# EAGLE schematic SparkFun_lsm9ds0-breakout (EAGLE 6.5.0)
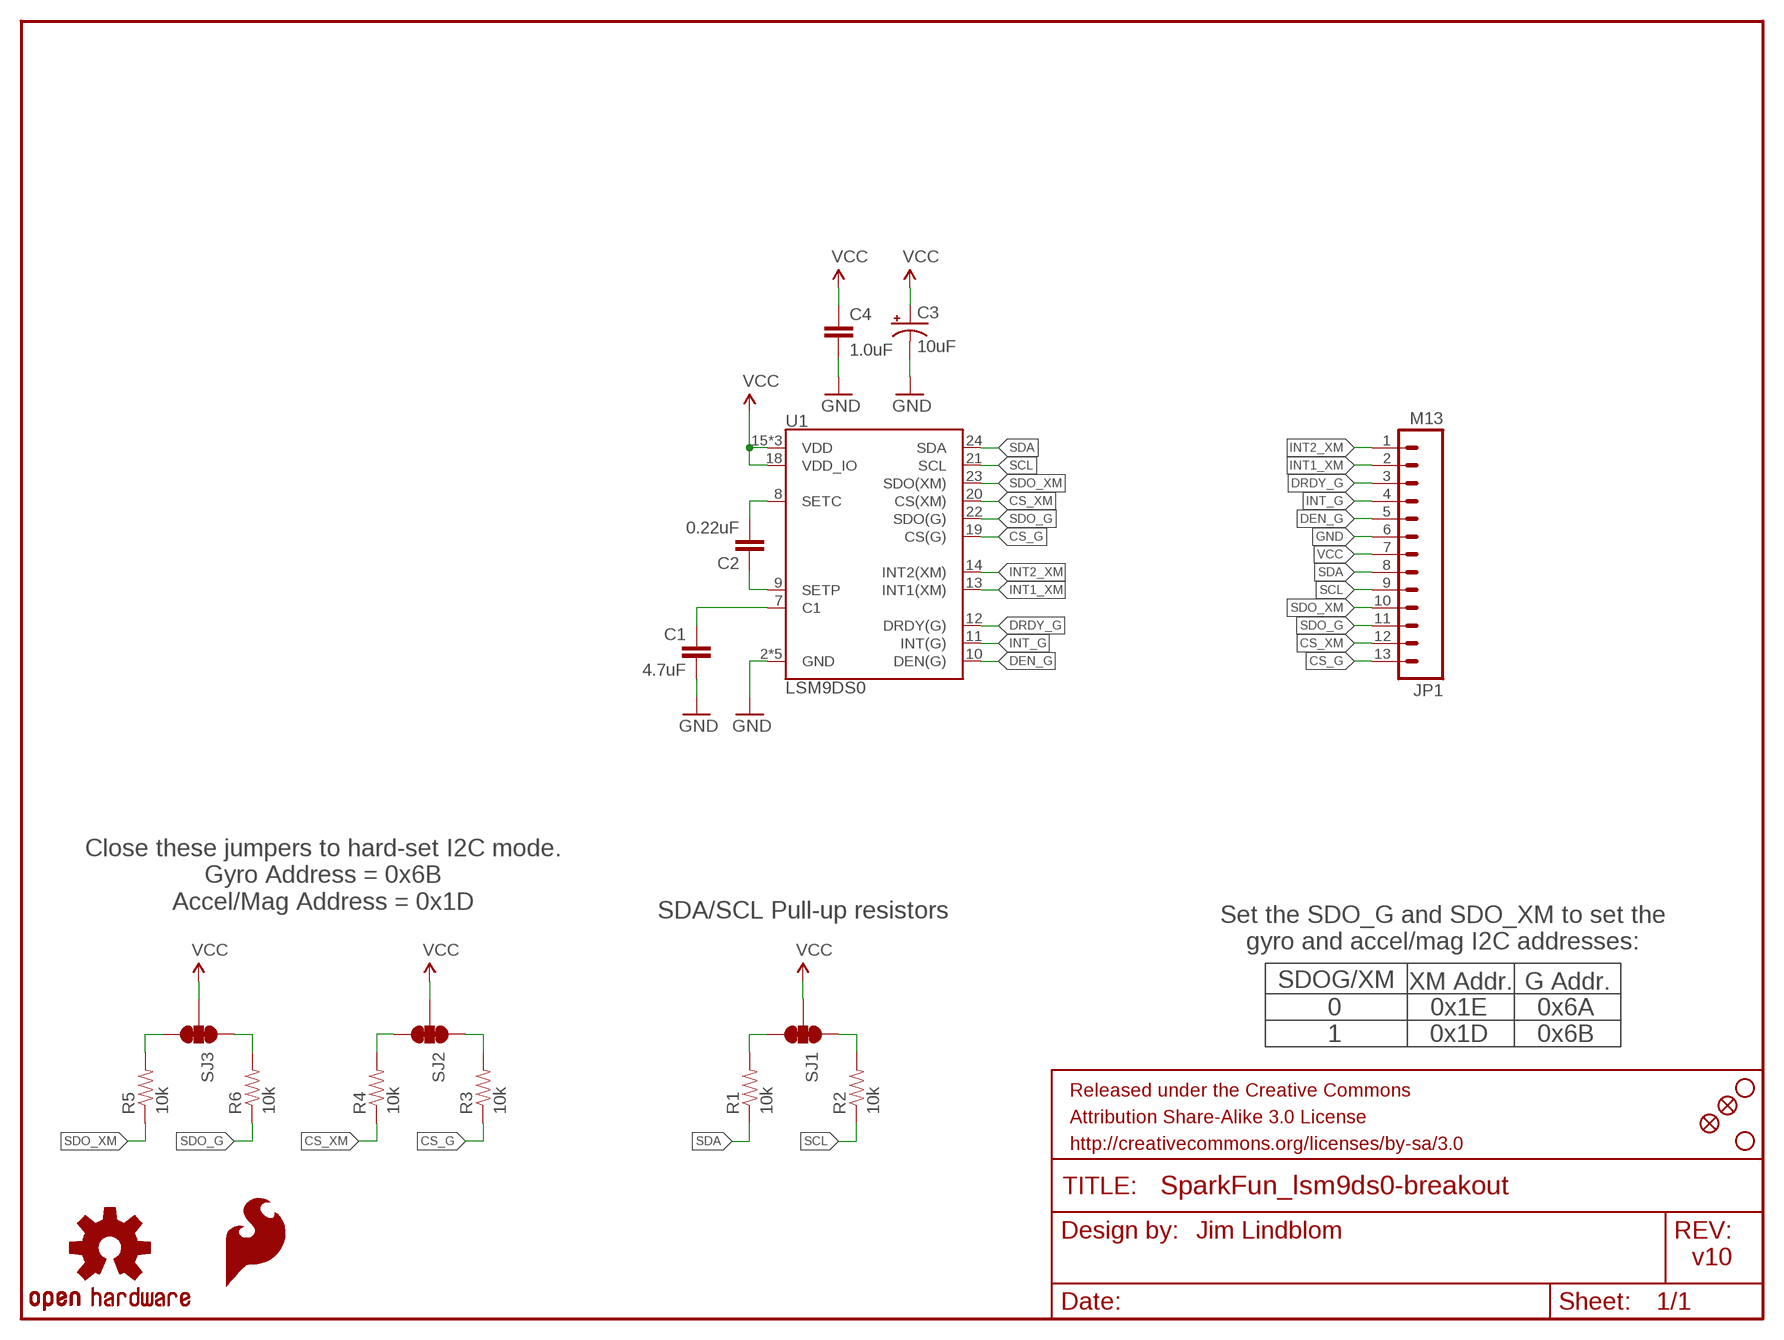
[diagram p0: schematic, sheet 1]

## Parts
C1  4.7uF  4.7UF-6.3V-10%(0603)0603  [0603-CAP]
C2  0.22uF  0.22UF-25V-10%(0603)  [0603-CAP]
C3  10uF  10UF-16V-10%(TANT)  [EIA3216]
C4  1.0uF  1.0UF-16V-10%(0603)  [0603-CAP]
FID1  FIDUCIALUFIDUCIAL  [MICRO-FIDUCIAL]
FID2  FIDUCIALUFIDUCIAL  [MICRO-FIDUCIAL]
FRAME1  FRAME-LETTER  [CREATIVE_COMMONS]
JP1  M13  [1X13]
LOGO1  OSHW-LOGOS  [OSHW-LOGO-S]
LOGO2  SFE_LOGO_FLAME.1_INCH  [SFE_LOGO_FLAME_.1]
LOGO3  SFE_LOGO_FLAME.1_INCH  [SFE_LOGO_FLAME_.1]
R1  10k  10K-1%RES-00824  [0603-RES]
R2  10k  10K-1%RES-00824  [0603-RES]
R3  10k  10K-1%RES-00824  [0603-RES]
R4  10k  10K-1%RES-00824  [0603-RES]
R5  10k  10K-1%RES-00824  [0603-RES]
R6  10k  10K-1%RES-00824  [0603-RES]
SJ1  SOLDERJUMPER_2WAYS  [SJ_3]
SJ2  SOLDERJUMPER_2WAYS  [SJ_3]
SJ3  SOLDERJUMPER_2WAYS  [SJ_3]
STANDOFF1  STAND-OFF  [STAND-OFF]
STANDOFF2  STAND-OFF  [STAND-OFF]
U1  LSM9DS0  [LGA-24]

## Nets
CS_G: JP1.13 R3.1 U1.19(CS(G))
CS_XM: JP1.12 R4.1 U1.20(CS(XM))
DEN_G: JP1.5 U1.10(DEN(G))
DRDY_G: JP1.3 U1.12(DRDY(G))
GND: C1.2 C3.C(-) C4.2 JP1.6 U1.2(GND) U1.3(GND) U1.4(GND) U1.5(GND) U1.6(GND)
INT1_XM: JP1.2 U1.13(INT1(XM))
INT2_XM: JP1.1 U1.14(INT2(XM))
INT_G: JP1.4 U1.11(INT(G))
N$1: C2.1 U1.9(SETP)
N$2: C2.2 U1.8(SETC)
N$3: C1.1 U1.7(C1)
N$4: R3.2 SJ2.1
N$5: R4.2 SJ2.3
N$6: R1.2 SJ1.3
N$7: R2.2 SJ1.1
N$12: R5.2 SJ3.3
N$13: R6.2 SJ3.1
SCL: JP1.9 R2.1 U1.21(SCL)
SDA: JP1.8 R1.1 U1.24(SDA)
SDO_G: JP1.11 R6.1 U1.22(SDO(G))
SDO_XM: JP1.10 R5.1 U1.23(SDO(XM))
VCC: C3.A(+) C4.1 JP1.7 SJ1.2 SJ2.2 SJ3.2 U1.15(VDD) U1.16(VDD) U1.17(VDD) U1.18(VDD_IO)

## Notes on the sheet
- Close these jumpers to hard-set I2C mode.
  Gyro Address = 0x6B
  Accel/Mag Address = 0x1D
- SDA/SCL Pull-up resistors
- Set the SDO_G and SDO_XM to set the
  gyro and accel/mag I2C addresses:
- SDOG/XM | XM Addr. | G Addr.
- 0
  1
- 0x1E
  0x1D
- 0x6A
  0x6B
- Jim Lindblom
- v10

## Library data of the parts
C1 = SparkFun-Capacitors:4.7UF-6.3V-10%(0603): CAP-08280; PROD_ID: CAP-08280
C2 = SparkFun-Capacitors:0.22UF-25V-10%(0603): CAP-07822; PROD_ID: CAP-07822
C3 = SparkFun-Capacitors:10UF-16V-10%(TANT): CAP-00811 1206/EIA-3216 Tantalum capacitor; PROD_ID: CAP-00811
C4 = SparkFun-Capacitors:1.0UF-16V-10%(0603): CAP-00868; PROD_ID: CAP-00868
FID1 FID2 = SparkFun-Aesthetics:FIDUCIAL: Fiducial Alignment Points Various fiducial points for machine vision alignment.
FRAME1 = SparkFun-Aesthetics:FRAME-LETTER: Schematic Frame Standard 8.5x11 US Letter frame
JP1 = SparkFun-Connectors:M13: 13-pin single row .1" header
LOGO1 = SparkFun-Aesthetics:OSHW-LOGO: Open Source Hardware Logo This logo indicates the piece of hardware it is found on incorporates a OSHW license and/or adheres to the definition of open source hardware found here: http://freedomdefined.org/OSHW
LOGO2 LOGO3 = SparkFun-Aesthetics:SFE_LOGO_FLAME: SFE Logo, flame only This is the SparkFun flame logo. The logo on the schematic will always be the same size; the package variant is the height of the flame. Default layer for the logo on the board is tSilk.
R1-R6 = SparkFun-Resistors:10K-1%: 10k-ohm SMT 1/10W - 1% (0603) RES-00824; PROD_ID: RES-00824
SJ1-SJ3 = SparkFun-Passives:SOLDERJUMPER_2WAY: Solder Jumper 2 way solder jumper
STANDOFF1 STANDOFF2 = SparkFun-Electromechanical:STAND-OFF: #4 Stand Off This is the mechanical footprint for a #4 phillips button head screw. Use the keepout ring to avoid running the screw head into surrounding components. SKU : PRT-00447
U1 = SparkFun-DigitalIC:LSM9DS0: LSM9DS0 3D Accelerometer, 3D Gyroscope, 3D Magnetomter Features: 3 acceleration channels, 3 angular rate channels, 3 magnetic field channels ±2/±4/±6/±8/±16 g linear acceleration full scale ±2/±4/±8/±12 gauss magnetic full scale ±245/±500/±2000 dps angular rate full scale 16-bit data output SPI / I2C serial interfaces Analog supply voltage 2.4 V to 3.6 V Power-down mode / low-power mode Programmable interrupt generators Embedded self-test Embedded temperature sensor Embedded FIFO Position and motion detection functions Click/double-click recognition